# Altium schematic sheet Power.SchDoc
size A4; SheetNumber: 2; SheetTotal: 3
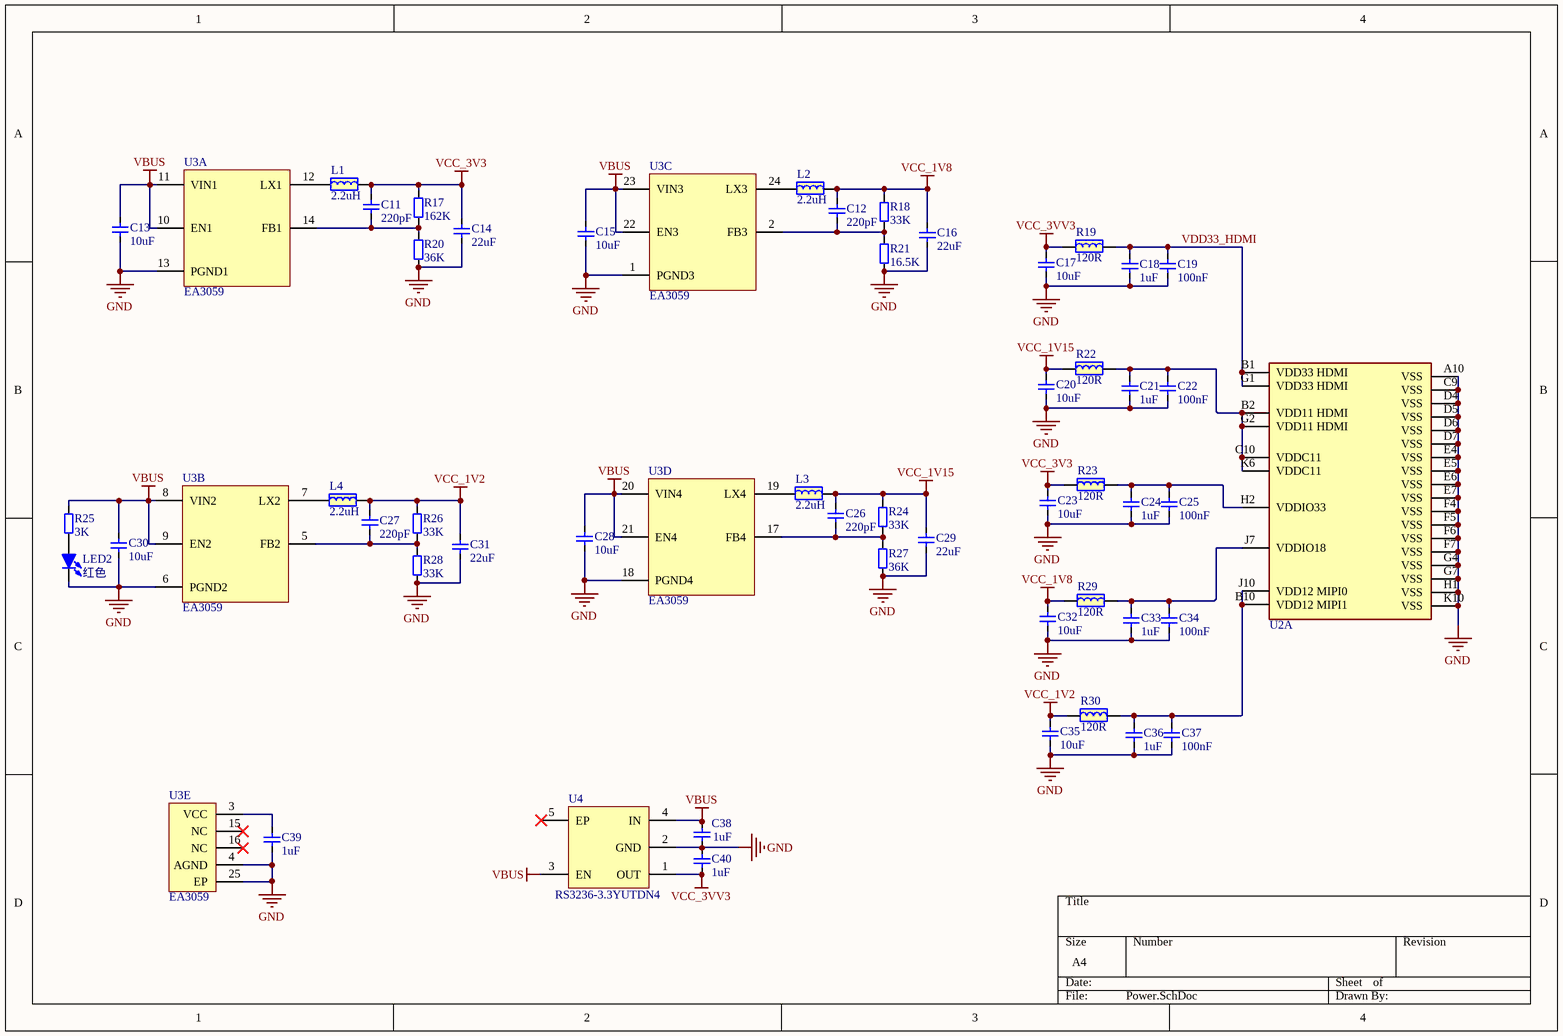
[diagram p0: Power.SchDoc]

## Parts
C11  220pF  [C0402_L]
C12  220pF  [C0402_L]
C13  10uF  [C0402_L]
C14  22uF  [C0402_L]
C15  10uF  [C0402_L]
C16  22uF  [C0402_L]
C17  10uF  [C0402_L]
C18  1uF  [C0402_L]
C19  100nF  [C0402_L]
C20  10uF  [C0402_L]
C21  1uF  [C0402_L]
C22  100nF  [C0402_L]
C23  10uF  [C0402_L]
C24  1uF  [C0402_L]
C25  100nF  [C0402_L]
C26  220pF  [C0402_L]
C27  220pF  [C0402_L]
C28  10uF  [C0402_L]
C29  22uF  [C0402_L]
C30  10uF  [C0402_L]
C31  22uF  [C0402_L]
C32  10uF  [C0402_L]
C33  1uF  [C0402_L]
C34  100nF  [C0402_L]
C35  10uF  [C0402_L]
C36  1uF  [C0402_L]
C37  100nF  [C0402_L]
C38  1uF  [C0402_L]
C39  1uF  [C0402_L]
C40  1uF  [C0402_L]
L1  2.2uH  [L0603]
L2  2.2uH  [L0603]
L3  2.2uH  [L0603]
L4  2.2uH  [L0603]
LED2  红色  [LED0402]
R17  162K  [R0402_L]
R18  33K  [R0402_L]
R19  120R  [L0402]
R20  36K  [R0402_L]
R21  16.5K  [R0402_L]
R22  120R  [L0402]
R23  120R  [L0402]
R24  33K  [R0402_L]
R25  3K  [R0402_L]
R26  33K  [R0402_L]
R27  36K  [R0402_L]
R28  33K  [R0402_L]
R29  120R  [L0402]
R30  120R  [L0402]
U2  TC358870XBG  [TC358870XBG]  (value not drawn)  (part A of 2)
U3  EA3059  [EA3059]  (parts A,B,C,D,E of 5)
U4  RS3236-3.3YUTDN4  [RS3236-3.3YUTDN4]

## Nets
GND: C13.1 C14.1 C15.1 C16.1 C17.1 C18.1 C19.1 C20.1 C21.1 C22.1 C23.1 C24.1 C25.1 C28.1 C29.1 C30.1 C31.1 C32.1 C33.1 C34.1 C35.1 C36.1 C37.1 C38.1 C39.1 C40.2 LED2.2(K) R20.1 R21.1 R27.1 R28.1 U2.A10(VSS) U2.C9(VSS) U2.D4(VSS) U2.D5(VSS) U2.D6(VSS) U2.D7(VSS) U2.E4(VSS) U2.E5(VSS) U2.E6(VSS) U2.E7(VSS) U2.F4(VSS) U2.F5(VSS) U2.F6(VSS) U2.F7(VSS) U2.G4(VSS) U2.G7(VSS) U2.H1(VSS) U2.K10(VSS) U3.1(PGND3) U3.4(AGND) U3.6(PGND2) U3.13(PGND1) U3.18(PGND4) U3.25(EP) U4.2(GND)
VBUS: C13.2 C15.2 C28.2 C30.2 C38.2 R25.2 U3.8(VIN2) U3.9(EN2) U3.10(EN1) U3.11(VIN1) U3.20(VIN4) U3.21(EN4) U3.22(EN3) U3.23(VIN3) U4.3(EN) U4.4(IN)
VCC_1V2: C27.2 C31.2 C35.2 L4.2 R26.2 R30.1
VCC_1V8: C12.2 C16.2 C32.2 L2.2 R18.2 R29.1
VCC_1V15: C20.2 C26.2 C29.2 L3.2 R22.1 R24.2
VCC_3V3: C11.2 C14.2 C23.2 L1.2 R17.2 R23.1
VCC_3VV3: C17.2 C40.1 R19.1 U4.1(OUT)
VDD33_HDMI: C18.2 C19.2 R19.2 U2.B1(VDD33_HDMI) U2.G1(VDD33_HDMI)
NetC11_1: C11.1 R17.1 R20.2 U3.14(FB1)
NetC12_1: C12.1 R18.1 R21.2 U3.2(FB3)
NetC21_2: C21.2 C22.2 R22.2 U2.B2(VDD11_HDMI) U2.C10(VDDC11) U2.G2(VDD11_HDMI) U2.K6(VDDC11)
NetC24_2: C24.2 C25.2 R23.2 U2.H2(VDDIO33)
NetC26_1: C26.1 R24.1 R27.2 U3.17(FB4)
NetC27_1: C27.1 R26.1 R28.2 U3.5(FB2)
NetC33_2: C33.2 C34.2 R29.2 U2.J7(VDDIO18)
NetC36_2: C36.2 C37.2 R30.2 U2.B10(VDD12_MIPI1) U2.J10(VDD12_MIPI0)
NetC39_2: C39.2 U3.3(VCC)
NetL1_1: L1.1 U3.12(LX1)
NetL2_1: L2.1 U3.24(LX3)
NetL3_1: L3.1 U3.19(LX4)
NetL4_1: L4.1 U3.7(LX2)
NetLED2_1: LED2.1(A) R25.1

Not connected (* = marked no-connect by the designer): U3 15(NC)* 16(NC)*; U4 5(EP)*

## Library data of the parts
C11-C40 = C: 贴片电容; BOM名称: 无极性贴片电容; 联系卖家，免费查找封装: 唯一出售店铺网址https://shop463601444.taobao.com
L1-L4 R19 R22 R23 R29 R30 = L-FB: 磁珠
LED2 = LED-SMD: 贴片LED; 封装库来自淘宝卖家 ID：黄晶宝石: 其他店铺购入均为假冒，请立即申请退款，本店奖励现金5~20元; BOM名称: 贴片LED
R17 R18 R20 R21 R24-R28 = R: 贴片电阻; 联系卖家，免费查找封装: 唯一出售店铺网址https://shop463601444.taobao.com; 封装库来自淘宝卖家ID：黄晶宝石: 其他店铺购入均为盗版假冒封装库，请立即申请退款; BOM名称: 贴片电阻
U3 = EA3059: 4CH_BUCK